# Altium schematic sheet SensorMCU.SchDoc
size A4
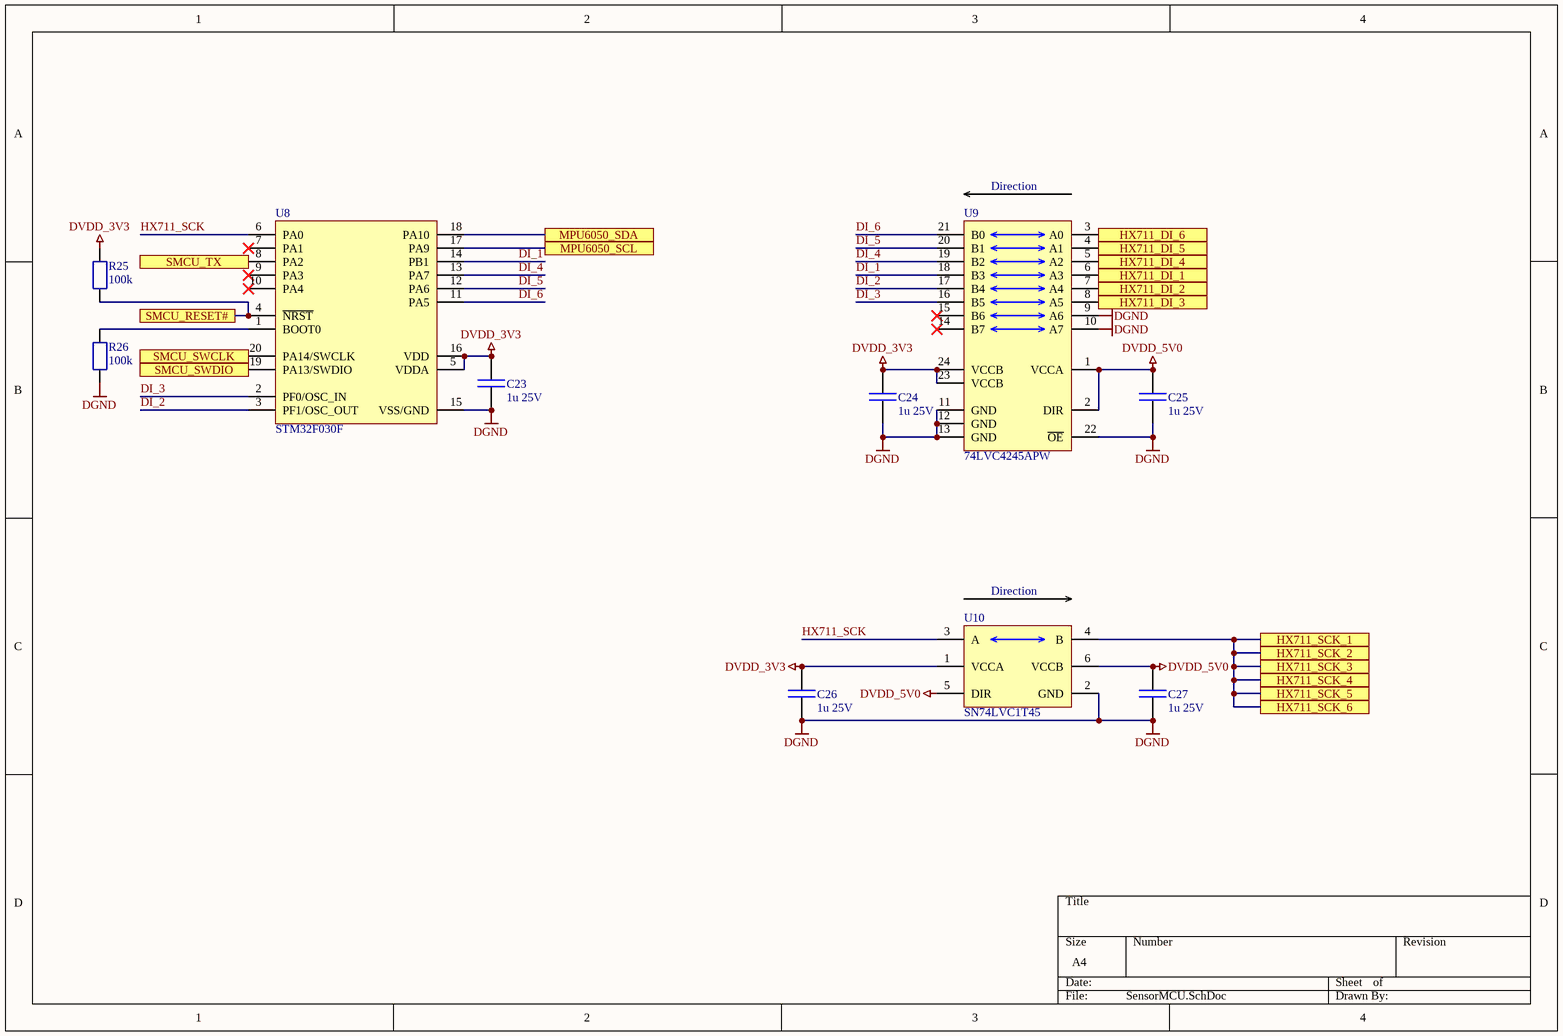
[diagram p0: SensorMCU.SchDoc]

## Parts
C23  1u 25V  [C_0603/1608]
C24  1u 25V  [C_0603/1608]
C25  1u 25V  [C_0603/1608]
C26  1u 25V  [C_0603/1608]
C27  1u 25V  [C_0603/1608]
R25  100k  [R_0603/1608]
R26  100k  [R_0603/1608]
U8  STM32F030F  [SO20_0.65]
U9  74LVC4245APW  [SO24_0.65]
U10  SN74LVC1T45  [SOT23-6]

## Ports
HX711_DI_1, HX711_DI_2, HX711_DI_3, HX711_DI_4, HX711_DI_5, HX711_DI_6, HX711_SCK_1, HX711_SCK_2, HX711_SCK_3, HX711_SCK_4, HX711_SCK_5, HX711_SCK_6, MPU6050_SCL, MPU6050_SDA, SMCU_RESET#, SMCU_SWCLK, SMCU_SWDIO, SMCU_TX

## Nets
DGND: C23.2 C24.2 C25.2 C26.2 C27.2 R26.2 U8.15(VSS/GND) U9.9(A6) U9.10(A7) U9.11(GND) U9.12(GND) U9.13(GND) U9.22(~{OE}) U10.2(GND)
DVDD_3V3: C23.1 C24.1 C26.1 R25.1 U8.5(VDDA) U8.16(VDD) U9.23(VCCB) U9.24(VCCB) U10.1(VCCA)
DVDD_5V0: C25.1 C27.1 U9.1(VCCA) U9.2(DIR) U10.5(DIR) U10.6(VCCB)
DI_1: U8.14(PB1) U9.18(B3)
DI_2: U8.3(PF1/OSC_OUT) U9.17(B4)
DI_3: U8.2(PF0/OSC_IN) U9.16(B5)
DI_4: U8.13(PA7) U9.19(B2)
DI_5: U8.12(PA6) U9.20(B1)
DI_6: U8.11(PA5) U9.21(B0)
HX711_DI_1: U9.6(A3) ; port HX711_DI_1
HX711_DI_2: U9.7(A4) ; port HX711_DI_2
HX711_DI_3: U9.8(A5) ; port HX711_DI_3
HX711_DI_4: U9.5(A2) ; port HX711_DI_4
HX711_DI_5: U9.4(A1) ; port HX711_DI_5
HX711_DI_6: U9.3(A0) ; port HX711_DI_6
HX711_SCK: U8.6(PA0) U10.3(A)
HX711_SCK_1: U10.4(B) ; port HX711_SCK_1, port HX711_SCK_2, port HX711_SCK_3, port HX711_SCK_4, port HX711_SCK_5, port HX711_SCK_6
MPU6050_SCL: U8.17(PA9) ; port MPU6050_SCL
MPU6050_SDA: U8.18(PA10) ; port MPU6050_SDA
SMCU_RESET#: R25.2 U8.4(~{NRST}) ; port SMCU_RESET#
SMCU_SWCLK: U8.20(PA14/SWCLK) ; port SMCU_SWCLK
SMCU_SWDIO: U8.19(PA13/SWDIO) ; port SMCU_SWDIO
SMCU_TX: U8.8(PA2) ; port SMCU_TX
NetR26_1: R26.1 U8.1(BOOT0)

Not connected (* = marked no-connect by the designer): U8 0(EP) 7(PA1)* 9(PA3)* 10(PA4)*; U9 14(B7)* 15(B6)*

## Notes on the sheet
- (near U9) Direction
- (near U10) Direction

## Library data of the parts
C23-C27 = Capacitor: Non-polarized capacitor
R25 R26 = Resistor
U8 = STM32F030F: 32-bit Cortex-M0
U9 = 74LVC4245APW: Logic level converter
U10 = SN74LVC1T45: Logic level converter